# Altium schematic sheet teensy.SchDoc
size 297 x 209 mm
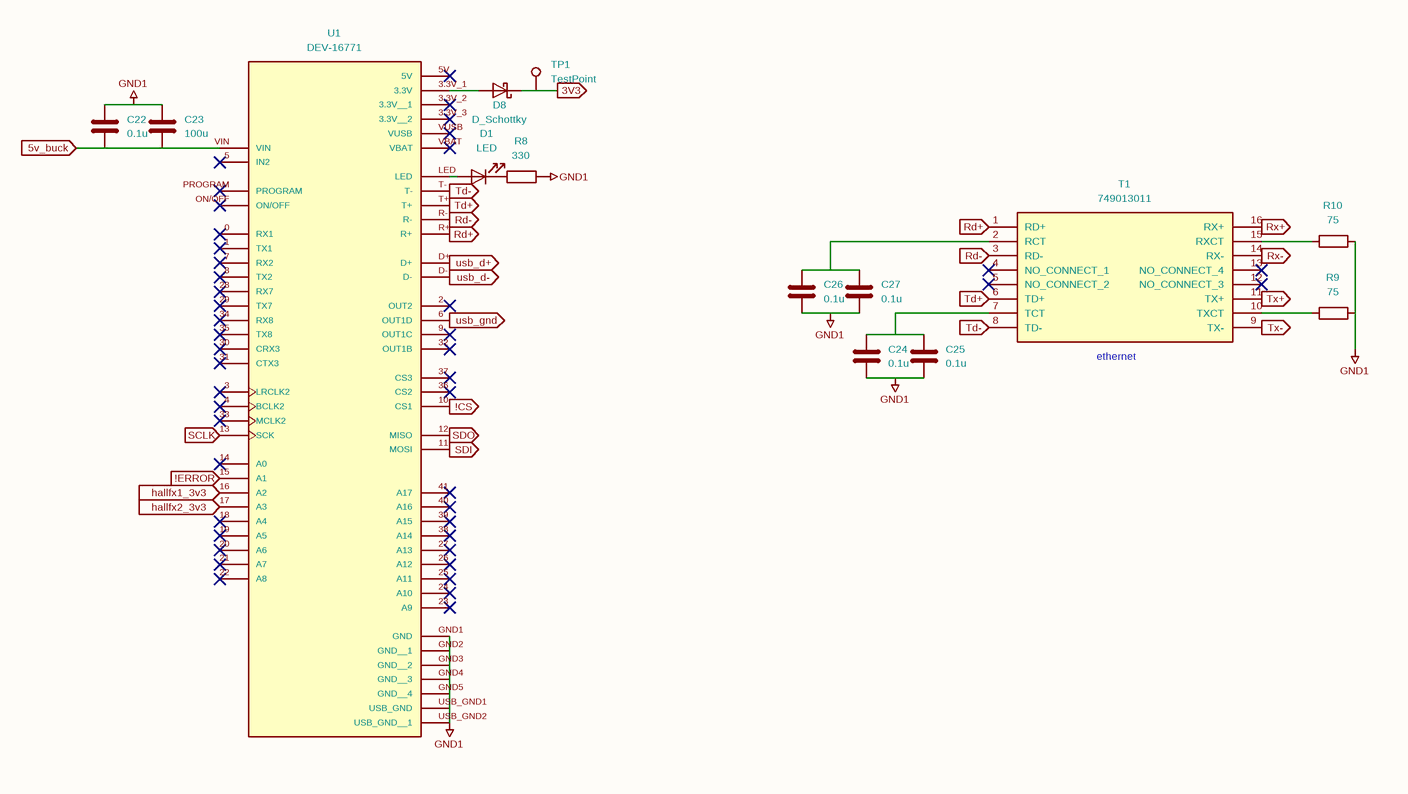
[diagram p0: teensy.SchDoc]

## Parts
C22  0.1u  [C_0603_1608Metric]
C23  100u  [C_1206_3216Metric]
C24  0.1u  [C_0603_1608Metric]
C25  0.1u  [C_0603_1608Metric]
C26  0.1u  [C_0603_1608Metric]
C27  0.1u  [C_0603_1608Metric]
D1  LED  [D_0603_1608Metric]
D8  D_Schottky  [D_0603_1608Metric]
R8  330  [R_0603_1608Metric]
R9  75  [R_0603_1608Metric]
R10  75  [R_0603_1608Metric]
T1  749013011  [749013011]
TP1  TestPoint  [TestPoint_Pad_2.0x2.0mm]
U1  DEV-16771  [MODULE_DEV-16771]

## Ports
3V3 (out), 5v_buck (in), !CS (out), !ERROR (in), hallfx1_3v3 (in), hallfx2_3v3 (in), Rd+ (in), Rd+ (out), Rd- (in), Rd- (out), Rx+ (in), Rx- (in), SCLK (in), SDI (out), SDO (in), Td+ (in), Td+ (out), Td- (in), Td- (out), Tx+ (in), Tx- (in), usb_d+ (in), usb_d- (in), usb_gnd (in)

## Nets
GND1: C22.1 C23.1 C24.2 C25.2 C26.2 C27.2 R8.2 R9.2 R10.2 U1.GND1(GND) U1.GND2(GND__1) U1.GND3(GND__2) U1.GND4(GND__3) U1.GND5(GND__4) U1.USB_GND1(USB_GND) U1.USB_GND2(USB_GND__1)
3V3: D8.1(K) TP1.1 ; port 3V3
5v_buck: C22.2 C23.2 U1.VIN ; port 5v_buck
!CS: U1.10(CS1) ; port !CS
!ERROR: U1.15(A1) ; port !ERROR
hallfx1_3v3: U1.16(A2) ; port hallfx1_3v3
hallfx2_3v3: U1.17(A3) ; port hallfx2_3v3
Rd+: T1.1(RD+) U1.R+ ; port Rd+
Rd-: T1.3(RD-) U1.R- ; port Rd-
Rx+: T1.16(RX+) ; port Rx+
Rx-: T1.14(RX-) ; port Rx-
SCLK: U1.13(SCK) ; port SCLK
SDI: U1.11(MOSI) ; port SDI
SDO: U1.12(MISO) ; port SDO
Td+: T1.6(TD+) U1.T+ ; port Td+
Td-: T1.8(TD-) U1.T- ; port Td-
Tx+: T1.11(TX+) ; port Tx+
Tx-: T1.9(TX-) ; port Tx-
usb_d+: U1.D+ ; port usb_d+
usb_d-: U1.D- ; port usb_d-
usb_gnd: U1.6(OUT1D) ; port usb_gnd
NetC24_1: C24.1 C25.1 T1.7(TCT)
NetC26_1: C26.1 C27.1 T1.2(RCT)
NetD1_1: D1.1(K) R8.1
NetD1_2: D1.2(A) U1.LED
NetD8_2: D8.2(A) U1.3.3V_1(3.3V)
NetR9_1: R9.1 T1.10(TXCT)
NetR10_1: R10.1 T1.15(RXCT)

Not connected (* = marked no-connect by the designer): T1 4(NO_CONNECT_1)* 5(NO_CONNECT_2)* 12(NO_CONNECT_3)* 13(NO_CONNECT_4)*; U1 0(RX1)* 1(TX1)* 2(OUT2)* 3(LRCLK2)* 3.3V_2(3.3V__1)* 3.3V_3(3.3V__2)* 4(BCLK2)* 5(IN2)* 5V* 7(RX2)* 8(TX2)* 9(OUT1C)* 14(A0)* 18(A4)* 19(A5)* 20(A6)* 21(A7)* 22(A8)* 23(A9)* 24(A10)* 25(A11)* 26(A12)* 27(A13)* 28(RX7)* 29(TX7)* 30(CRX3)* 31(CTX3)* 32(OUT1B)* 33(MCLK2)* 34(RX8)* 35(TX8)* 36(CS2)* 37(CS3)* 38(A14)* 39(A15)* 40(A16)* 41(A17)* ON/OFF* PROGRAM* VBAT* VUSB*

## Notes on the sheet
- (near T1) ethernet
- 1
- 2
- 3
- 4
- 5
- 6
- A
- B
- C
- D
- Title:
- File: teensy.kicad_sch
- Sheet: /
- KiCad E.D.A.  kicad (5.1.4)-1
- Size: A4
- Date:
- Rev:
- Id: 1/1

## Library data of the parts
C22-C27 = C
  C22 C24-C27: Value: 0.1u; Footprint: Capacitor_SMD:C_0603_1608Metric
  C23: Value: 100u; Footprint: Capacitor_SMD:C_1206_3216Metric
R8-R10 = R: Footprint: Resistor_SMD:R_0603_1608Metric
  R8: Value: 330
  R9 R10: Value: 75
T1 = 749013011: Manufacturer_Name: Wurth Elektronik; Height: 5.33; Mouser Part Number: 710-749013011; Mouser Price/Stock: https://www.mouser.co.uk/ProductDetail/Wurth-Elektronik/749013011?qs=2sV1BwmkawRYxGj1O9AWzA%3D%3D; Manufacturer_Part_Number: 749013011; Value: 749013011; Footprint: 21xt_footprints:749013011
U1 = DEV-16771: MANUFACTURER: SparkFun Electronics; PARTREV: 4.1; MAXIMUM_PACKAGE_HEIGHT: 4.07mm; STANDARD: Manufacturer recommendations; Value: DEV-16771; Footprint: 21xt_footprints:MODULE_DEV-16771
D1 = LED: Value: LED; Footprint: Diode_SMD:D_0603_1608Metric
D8 = D_Schottky: Value: D_Schottky; Footprint: Diode_SMD:D_0603_1608Metric
TP1 = TestPoint: Value: TestPoint; Footprint: TestPoint:TestPoint_Pad_2.0x2.0mm